# Altium project pay-ssm.PrjPCB (part 2 of 2)

## Sheet MF Thermistors.SchDoc
size A4; DrawnBy: Lorna Lan, Dylan Vogel; DocumentNumber: 17; Revision: v4.1; SheetNumber: 17; SheetTotal: 20
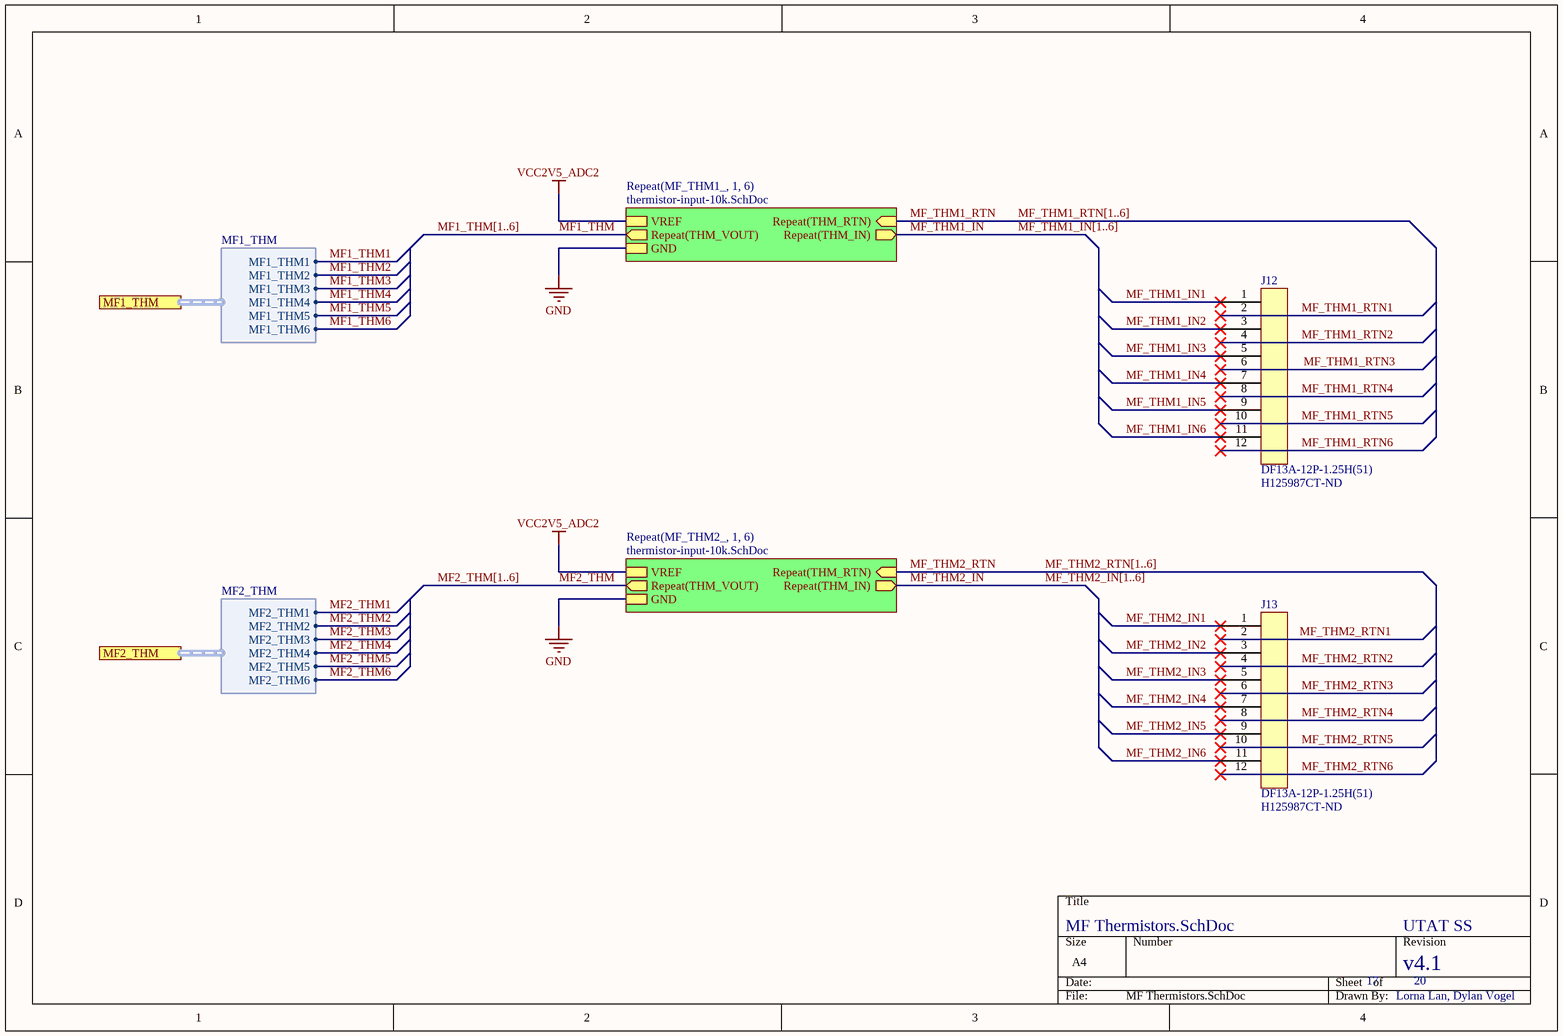
[diagram p8: MF Thermistors.SchDoc]

### Parts
J12  DF13A-12P-1.25H(51)  Supplier Part Number 1: H125987CT-ND  [DF13A-12P-1.25H(51)]
J13  DF13A-12P-1.25H(51)  Supplier Part Number 1: H125987CT-ND  [DF13A-12P-1.25H(51)]

### Sub-sheets
Repeat(MF_THM1_, 1, 6) = thermistor-input-10k.SchDoc (file not in this document): Repeat(THM_IN) (out), Repeat(THM_RTN) (in), Repeat(THM_VOUT) (out), GND, VREF
Repeat(MF_THM2_, 1, 6) = thermistor-input-10k.SchDoc (file not in this document): Repeat(THM_IN) (out), Repeat(THM_RTN) (in), Repeat(THM_VOUT) (out), GND, VREF

### Ports
MF1_THM (harness MF1_THM), MF2_THM (harness MF2_THM)

### Harnesses
MF1_THM: MF1_THM1, MF1_THM2, MF1_THM3, MF1_THM4, MF1_THM5, MF1_THM6
MF2_THM: MF2_THM1, MF2_THM2, MF2_THM3, MF2_THM4, MF2_THM5, MF2_THM6

### Nets
GND: sheet Repeat(MF_THM1_, 1, 6)/GND, sheet Repeat(MF_THM2_, 1, 6)/GND
VCC2V5_ADC2: sheet Repeat(MF_THM1_, 1, 6)/VREF, sheet Repeat(MF_THM2_, 1, 6)/VREF
MF1_THM: sheet Repeat(MF_THM1_, 1, 6)/Repeat(THM_VOUT)
MF1_THM1: port MF1_THM.MF1_THM1
MF1_THM2: port MF1_THM.MF1_THM2
MF1_THM3: port MF1_THM.MF1_THM3
MF1_THM4: port MF1_THM.MF1_THM4
MF1_THM5: port MF1_THM.MF1_THM5
MF1_THM6: port MF1_THM.MF1_THM6
MF2_THM: sheet Repeat(MF_THM2_, 1, 6)/Repeat(THM_VOUT)
MF2_THM1: port MF2_THM.MF2_THM1
MF2_THM2: port MF2_THM.MF2_THM2
MF2_THM3: port MF2_THM.MF2_THM3
MF2_THM4: port MF2_THM.MF2_THM4
MF2_THM5: port MF2_THM.MF2_THM5
MF2_THM6: port MF2_THM.MF2_THM6
MF_THM1_IN: sheet Repeat(MF_THM1_, 1, 6)/Repeat(THM_IN)
MF_THM1_IN1: J12.1
MF_THM1_IN2: J12.3
MF_THM1_IN3: J12.5
MF_THM1_IN4: J12.7
MF_THM1_IN5: J12.9
MF_THM1_IN6: J12.11
MF_THM1_RTN: sheet Repeat(MF_THM1_, 1, 6)/Repeat(THM_RTN)
MF_THM1_RTN1: J12.2
MF_THM1_RTN2: J12.4
MF_THM1_RTN3: J12.6
MF_THM1_RTN4: J12.8
MF_THM1_RTN5: J12.10
MF_THM1_RTN6: J12.12
MF_THM2_IN: sheet Repeat(MF_THM2_, 1, 6)/Repeat(THM_IN)
MF_THM2_IN1: J13.1
MF_THM2_IN2: J13.3
MF_THM2_IN3: J13.5
MF_THM2_IN4: J13.7
MF_THM2_IN5: J13.9
MF_THM2_IN6: J13.11
MF_THM2_RTN: sheet Repeat(MF_THM2_, 1, 6)/Repeat(THM_RTN)
MF_THM2_RTN1: J13.2
MF_THM2_RTN2: J13.4
MF_THM2_RTN3: J13.6
MF_THM2_RTN4: J13.8
MF_THM2_RTN5: J13.10
MF_THM2_RTN6: J13.12

### Buses and harness runs
bus MF1_THM[1..6]
bus MF2_THM[1..6]
bus MF_THM1_IN[1..6]
bus MF_THM1_RTN[1..6]
bus MF_THM2_IN[1..6]
bus MF_THM2_RTN[1..6]

### Library data of the parts
J12 J13 = DF13A-12P-1.25H(51): 12 pos DF13 right angle surface mount connector; Manufacturer: Hirose; Current Rating: 1A; Voltage Rating: 150V; Contact Resistance: 30mR; Number of Positions: 12; Pitch: 1.25mm; Supplier 1: Digi-Key; Manufacturer Part Number: DF13A-12P-1.25H(51); Stock 1: 878; Pricing 1: 1=1.69, 10=1.536, 100=1.3167, 500=1.09726 (USD); Contact Material: Brass,Copper Alloy; Contact Plating: Gold; Housing Color: Beige; Housing Material: Polyamide; Min Operating Temperature: -35°C; Max Operating Temperature: 85°C; Contact Gender: Male; Package Quantity: 1000; Number of Rows: 1; Packaging: Tape and Reel; Max Current Rating: 1A; Termination: Solder; Number of Contacts: 12; Max Voltage Rating (AC): 150V; Orientation: Right Angle; Length: 19.65mm; Depth: 6.5mm; Radiation Hardening: No; Lead Free: Lead Free; ComponentLink1URL: http://www.mouser.com/ds/2/185/DF13_catalog-939190.pdf?src-supplier=Mouser; ComponentLink1Description: http://www.mouser.com/ds/2/185/DF13_catalog-939190.pdf?src-supplier=Mouser; ComponentLink2URL: http://www.hirose.co.jp/cataloge_hp/en_DF13_20130411.pdf?src-supplier=Future+Electronics; ComponentLink2Description: http://www.hirose.co.jp/cataloge_hp/en_DF13_20130411.pdf?src-supplier=Future+Electronics; ComponentLink3URL: https://www.verical.com/server-webapp/html/getDatasheet?partID=429813&src-supplier=Verical; ComponentLink3Description: https://www.verical.com/server-webapp/html/getDatasheet?partID=429813&src-supplier=Verical

## Sheet ADC Breakout.SchDoc
size A4; DrawnBy: Lorna Lan, Dylan Vogel; DocumentNumber: 7; Revision: v4.2; SheetNumber: 7; SheetTotal: 20
Used 2 times, as channels ADC1, ADC2. Parts and nets are listed once, with the designators drawn on the sheet.
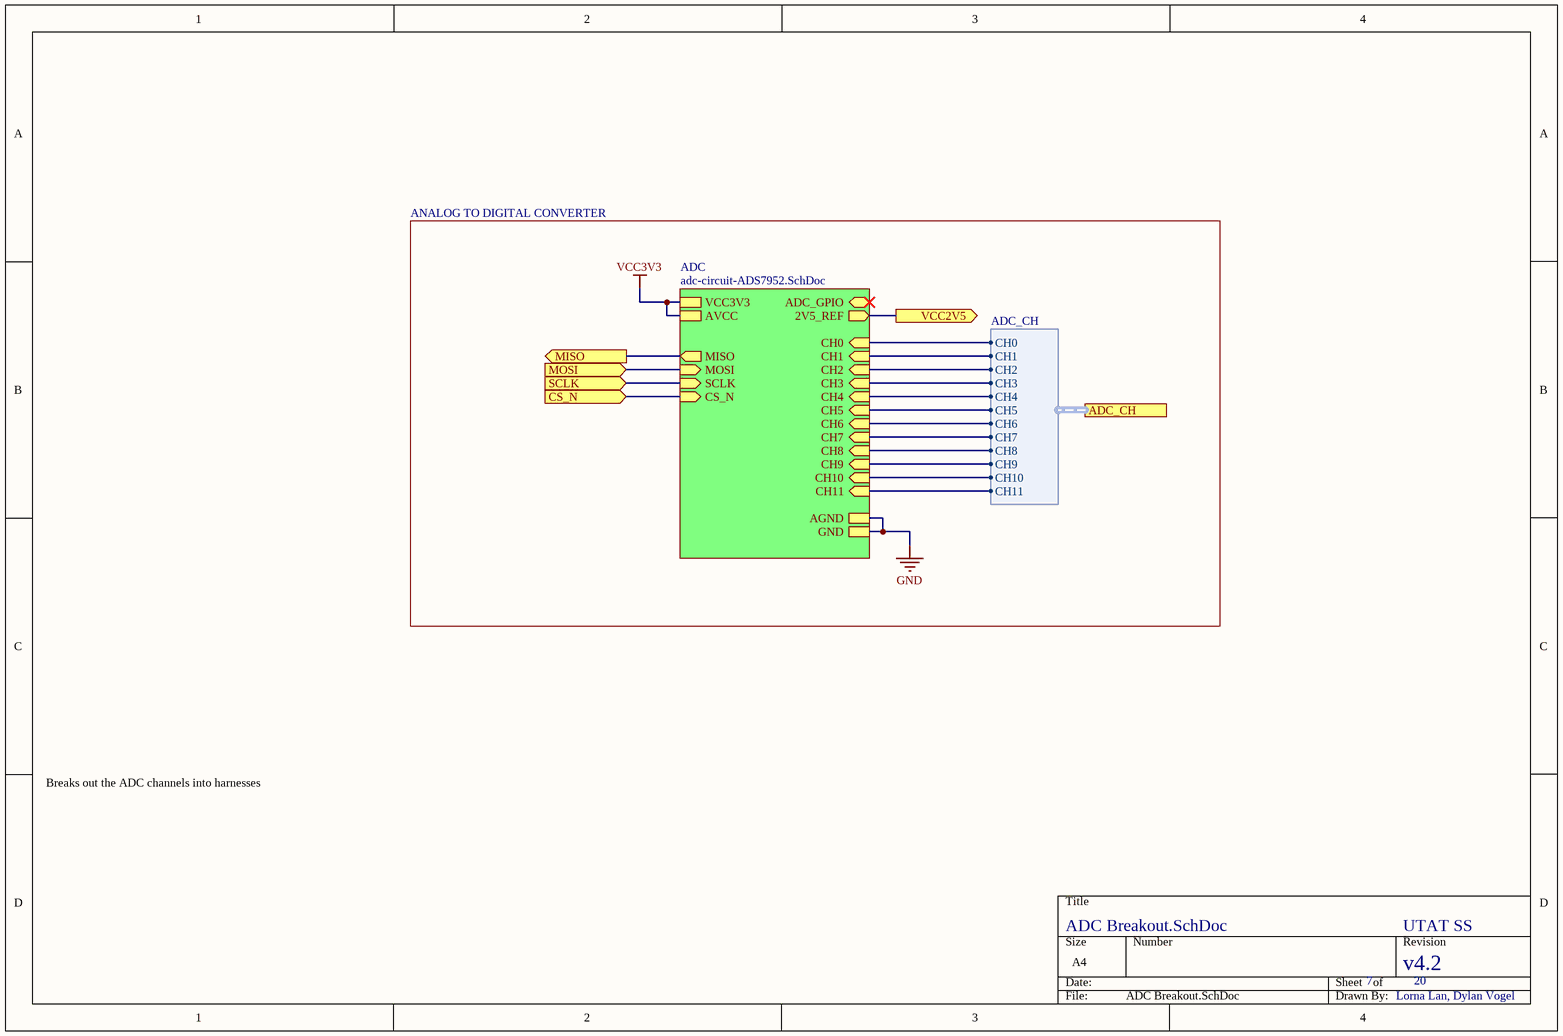
[diagram p9: ADC Breakout.SchDoc]

### Sub-sheets
ADC = adc-circuit-ADS7952.SchDoc (file not in this document): ADC_GPIO (bidir), CS_N (in), SCLK (in), MOSI (in), CH9 (in), CH7 (in), CH8 (in), MISO (out), CH10 (in), CH5 (in), CH1 (in), CH4 (in), CH3 (in), CH11 (in), CH0 (in), VCC3V3, 2V5_REF (out), CH2 (in), AVCC, AGND, CH6 (in), GND

### Ports
ADC_CH (harness ADC_CH), CS_N (in), MISO (out), MOSI (in), SCLK (in), VCC2V5 (out)

### Harnesses
ADC_CH: CH0, CH1, CH2, CH3, CH4, CH5, CH6, CH7, CH8, CH9, CH10, CH11

### Nets
GND: sheet ADC/AGND, sheet ADC/GND
VCC3V3: sheet ADC/VCC3V3, sheet ADC/AVCC
CS_N: port CS_N, sheet ADC/CS_N
MISO: port MISO, sheet ADC/MISO
MOSI: port MOSI, sheet ADC/MOSI
SCLK: port SCLK, sheet ADC/SCLK
VCC2V5: port VCC2V5, sheet ADC/2V5_REF
(unnamed): sheet ADC/CH9, port ADC_CH.CH9
(unnamed): sheet ADC/CH7, port ADC_CH.CH7
(unnamed): sheet ADC/CH8, port ADC_CH.CH8
(unnamed): sheet ADC/CH10, port ADC_CH.CH10
(unnamed): sheet ADC/CH5, port ADC_CH.CH5
(unnamed): sheet ADC/CH1, port ADC_CH.CH1
(unnamed): sheet ADC/CH4, port ADC_CH.CH4
(unnamed): sheet ADC/CH3, port ADC_CH.CH3
(unnamed): sheet ADC/CH11, port ADC_CH.CH11
(unnamed): sheet ADC/CH0, port ADC_CH.CH0
(unnamed): sheet ADC/CH2, port ADC_CH.CH2
(unnamed): sheet ADC/CH6, port ADC_CH.CH6

### Channels
ADC1: ports CS_N=ADC1_CS_N MISO=MISO MOSI=MOSI SCLK=SCK VCC2V5=VCC2V5_ADC1
ADC2: ports CS_N=ADC2_CS_N MISO=MISO MOSI=MOSI SCLK=SCK VCC2V5=VCC2V5_ADC2

### Notes on the sheet
- ANALOG TO DIGITAL CONVERTER
- Breaks out the ADC channels into harnesses

## Sheet Boost Converter 6V.SchDoc
size A4; DrawnBy: Lorna Lan; DocumentNumber: 14; Revision: v4.2; SheetNumber: 14; SheetTotal: 20
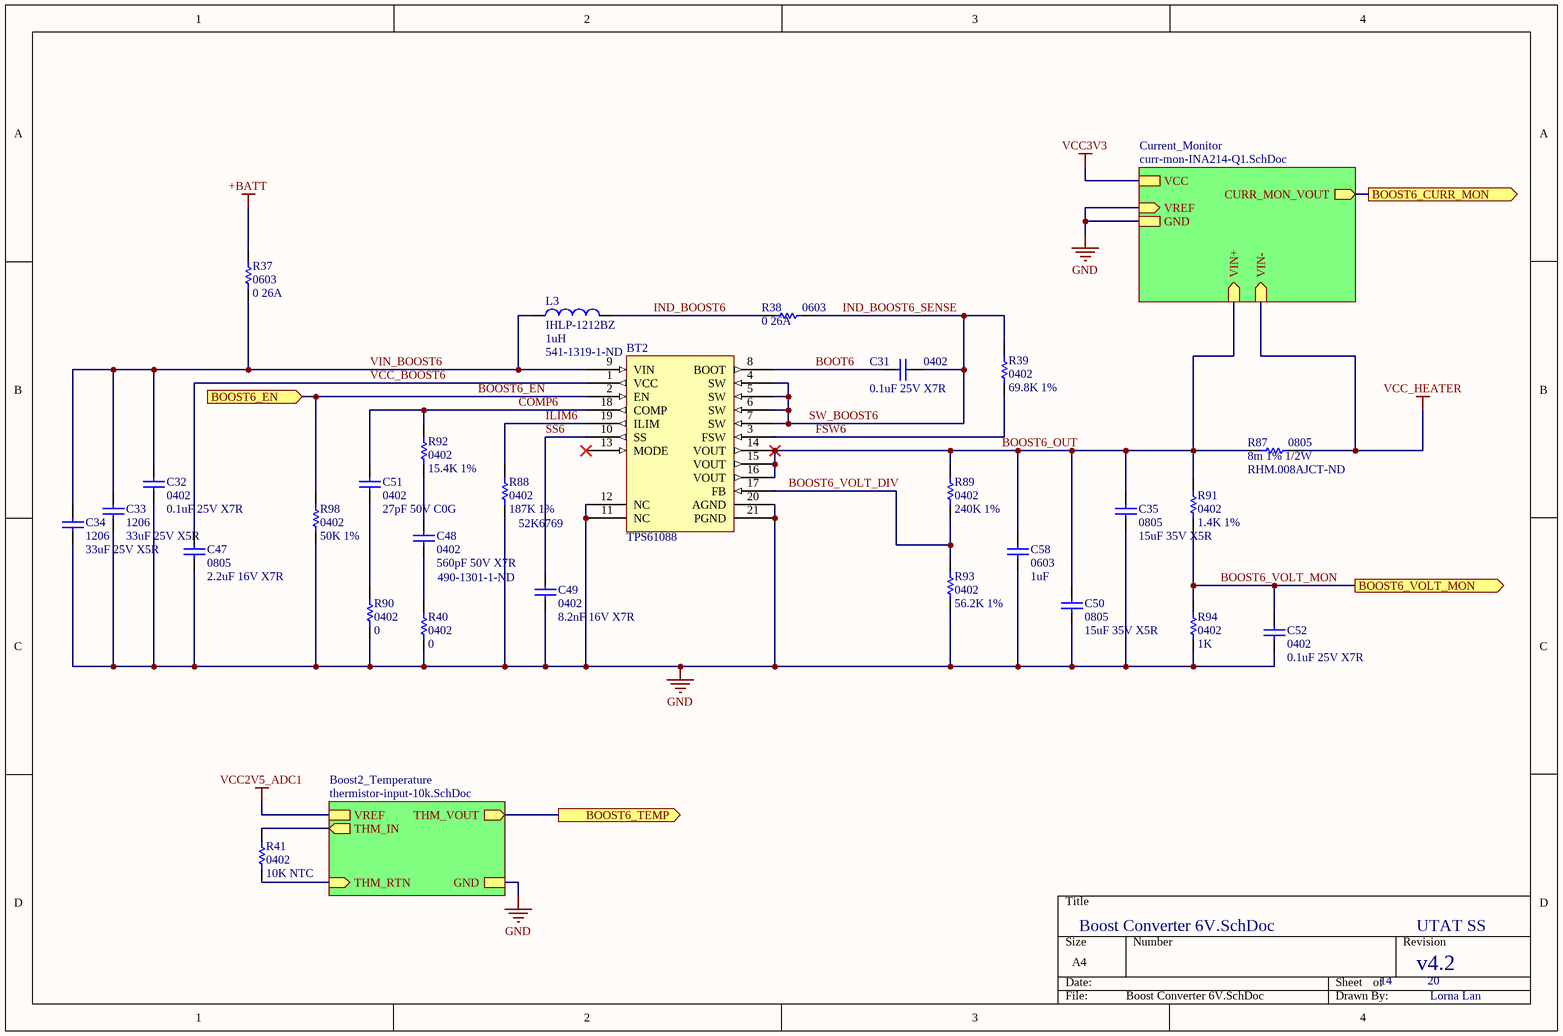
[diagram p10: Boost Converter 6V.SchDoc]

### Parts
BT2  TPS61088  [QFN50P450X350X100-21N]
C31  0402  value 0.1uF 25V X7R  [CAP0402R]
C32  0402  value 0.1uF 25V X7R  [CAP0402R]
C33  1206  value 33uF 25V X5R  [CAP1206R]
C34  1206  value 33uF 25V X5R  [CAP1206R]
C35  0805  value 15uF 35V X5R  [CAP0805R]
C47  0805  value 2.2uF 16V X7R  [CAP0805R]
C48  0402  value 560pF 50V X7R  Supplier Part Number 1: 490-1301-1-ND  [CAP0402R]
C49  0402  value 8.2nF 16V X7R  [CAP0402R]
C50  0805  value 15uF 35V X5R  [CAP0805R]
C51  0402  value 27pF 50V C0G  [CAP0402R]
C52  0402  value 0.1uF 25V X7R  [CAP0402R]
C58  0603  value 1uF  [CAP0603R]
L3  IHLP-1212BZ  Inductance: 1uH  Supplier Part Number 1: 541-1319-1-ND  [IHLP-1212BZ]
R37  0603  value 0 26A  [RES0603R]
R38  0603  value 0 26A  [RES0603R]
R39  0402  value 69.8K 1%  [RES0402R]
R40  0402  value 0  [RES0402R]
R41  0402  value 10K NTC  [RES0402R]
R87  0805  value 8m 1% 1/2W  Supplier Part Number 1: RHM.008AJCT-ND  [RES0805R]
R88  0402  value 187K 1%  Supplier Part Number 1: 52K6769  [RES0402R]
R89  0402  value 240K 1%  [RES0402R]
R90  0402  value 0  [RES0402R]
R91  0402  value 1.4K 1%  [RES0402R]
R92  0402  value 15.4K 1%  [RES0402R]
R93  0402  value 56.2K 1%  [RES0402R]
R94  0402  value 1K  [RES0402R]
R98  0402  value 50K 1%  [RES0402R]

### Sub-sheets
Boost2_Temperature = thermistor-input-10k.SchDoc (file not in this document): GND, VREF, THM_RTN (in), THM_IN (out), THM_VOUT (out)
Current_Monitor = curr-mon-INA214-Q1.SchDoc (file not in this document): VCC, VREF (in), VIN+ (in), GND, VIN- (in), CURR_MON_VOUT (out)

### Ports
BOOST6_CURR_MON (out), BOOST6_EN (in), BOOST6_TEMP (out), BOOST6_VOLT_MON (out)

### Nets
+BATT: R37.2
GND: BT2.11(NC) BT2.12(NC) BT2.20(AGND) BT2.21(PGND) C32.1 C33.1 C34.1 C35.1 C47.1 C49.1 C50.1 C52.1 C58.1 R40.1 R88.1 R90.1 R93.1 R94.1 R98.1 ; sheet Boost2_Temperature/GND, sheet Current_Monitor/VREF, sheet Current_Monitor/GND
VCC2V5_ADC1: sheet Boost2_Temperature/VREF
VCC_HEATER: R87.2 ; sheet Current_Monitor/VIN-
BOOST6_CURR_MON: port BOOST6_CURR_MON, sheet Current_Monitor/CURR_MON_VOUT
BOOST6_EN: BT2.2(EN) R98.2 ; port BOOST6_EN
BOOST6_OUT: BT2.14(VOUT) BT2.15(VOUT) BT2.16(VOUT) C35.2 C50.2 C58.2 R87.1 R89.2 R91.2 ; sheet Current_Monitor/VIN+
BOOST6_TEMP: port BOOST6_TEMP, sheet Boost2_Temperature/THM_VOUT
BOOST6_VOLT_DIV: BT2.17(FB) R89.1 R93.2
BOOST6_VOLT_MON: C52.2 R91.1 R94.2 ; port BOOST6_VOLT_MON
BOOT6: BT2.8(BOOT) C31.1
COMP6: BT2.18(COMP) C51.2 R92.2
FSW6: BT2.3(FSW) R39.1
ILIM6: BT2.19(ILIM) R88.2
IND_BOOST6: L3.2 R38.1
IND_BOOST6_SENSE: BT2.4(SW) BT2.5(SW) BT2.6(SW) BT2.7(SW) C31.2 R38.2 R39.2  [also labelled SW_BOOST6]
SS6: BT2.10(SS) C49.2
VCC_BOOST6: BT2.1(VCC) C47.2
VIN_BOOST6: BT2.9(VIN) C32.2 C33.2 C34.2 L3.1 R37.1
NetC48_1: C48.1 R40.2
NetC48_2: C48.2 R92.1
NetC51_1: C51.1 R90.2
NetR41_1: R41.1 ; sheet Boost2_Temperature/THM_RTN
NetR41_2: R41.2 ; sheet Boost2_Temperature/THM_IN

Not connected (* = marked no-connect by the designer): BT2 13(MODE)*

### Library data of the parts
BT2 = TPS61088: Boost converter; Supplier 1: Digi-Key; Supplier Part Number 1: 296-42129-1-ND
C31 C32 C48 C49 C51 C52 = CAP0402: 0402 capacitor
  C48: Supplier 1: Digi-Key
  C49: Supplier 1: Digi-Key; Supplier Part Number 1: 490-6338-1-ND
  C51: Supplier 1: Digi-Key; Supplier Part Number 1: 490-5869-1-ND
C33 C34 = CAP1206: 1206 capacitor; Supplier 1: Digi-Key; Supplier Part Number 1: 445-8046-1-ND
C35 C47 C50 = CAP0805: 0805 capacitor
  C35 C50: Supplier 1: Mouser; Supplier Part Number 1: 810-C2012X5R1V156M1C
  C47: Supplier 1: Digi-Key; Supplier Part Number 1: 490-3906-1-ND
C58 = CAP0603: 0603 capacitor; Manufacturer: KEMET; Manufacturer Part Number: C0603C105K4RACAUTO; Tolerance: 10%; Voltage Rating: 16V; Supplier 1: Digi-Key; Supplier Part Number 1: 399-17704-1-ND; Stock 1: 376276; Pricing 1: 1=0.17, 10=0.12, 100=0.0564, 500=0.03952, 1000=0.03273 (USD); Mount: Surface Mount; Case/Package: 0603; Case Code (Imperial): 0603; Case Code (Metric): 1608; Min Operating Temperature: -55°C; Max Operating Temperature: 125°C; Packaging: Cut Tape; Capacitance: 1uF; Ratings: AEC-Q200; Supplier 2: Digi-Key; Supplier Part Number 2: 587-3467-1-ND
L3 = IND_IHLP-1212BZ: 1µH Shielded Molded Inductor 5A 24mOhm Max Nonstandard; Manufacturer: Vishay Dale; Manufacturer Part Number: IHLP1212BZER1R0M11; Core Material: Metal,Composite; Self Resonant Frequency: 75MHz; Saturation Current: 4.5A; Tolerance: 20%; DC Resistance (DCR): 24mR; Test Frequency: 100kHz; Supplier 1: Digi-Key; Stock 1: 196362; Pricing 1: 1=1.45, 10=1.346, 100=0.9729, 500=0.7452, 1000=0.6624 (USD); Mount: Surface Mount; Case/Package: 1212; Number of Pins: 2; Case Code (Metric): 3630; Case Code (Imperial): 1212; Contact Plating: Tin; Min Operating Temperature: -55°C; Max Operating Temperature: 125°C; Shielding: Shielded; Packaging: Tape and Reel; Package Quantity: 3000; Current Rating: 5A; Inductance Tolerance: 20%; Max DC Current: 5A; Termination: SMD/SMT; RMS Current (Irms): 5A; Military Standard: Not; Length: 3.6mm; Height: 2mm; Width: 0.118inch; Height - Seated (Max): 0.079inch; Depth: 3.2mm; Radiation Hardening: No; REACH SVHC: Unknown; Lead Free: Lead Free; ComponentLink1URL: http://www.mouser.com/ds/2/427/lp12bz11-244380.pdf?src-supplier=Mouser; ComponentLink1Description: http://www.mouser.com/ds/2/427/lp12bz11-244380.pdf?src-supplier=Mouser; ComponentLink2URL: http://www.vishay.com/docs/34289/lp12bz11.pdf?src-supplier=Digi-Key; ComponentLink2Description: http://www.vishay.com/docs/34289/lp12bz11.pdf?src-supplier=Digi-Key; ComponentLink3URL: http://www.vishay.com/docs/34289/lp12bz11.pdf?src-supplier=Avnet; ComponentLink3Description: http://www.vishay.com/docs/34289/lp12bz11.pdf?src-supplier=Avnet; ComponentLink4URL: http://www.farnell.com/datasheets/652599.pdf?src-supplier=Element14; ComponentLink4Description: http://www.farnell.com/datasheets/652599.pdf?src-supplier=Element14; ComponentLink5URL: http://www.vishay.com/docs/34289/lp12bz11.pdf?src-supplier=Avnet+Europe; ComponentLink5Description: http://www.vishay.com/docs/34289/lp12bz11.pdf?src-supplier=Avnet+Europe; ComponentLink6URL: https://www.verical.com/server-webapp/html/getDatasheet?partID=180380&src-supplier=Verical; ComponentLink6Description: https://www.verical.com/server-webapp/html/getDatasheet?partID=180380&src-supplier=Verical
R37 R38 = RES0603: 0603 resistor; Supplier 1: Digi-Key; Supplier Part Number 1: 2019-TLRZ1JTTDCT-ND
R39 R41 R88 R89 R91-R94 R98 = RES0402: 0402 resistor
  R39: Supplier 1: Digi-Key; Supplier Part Number 1: 541-69.8KLCT-ND
  R88: Supplier 1: Newark
  R89 R93: Supplier 1: Digi-Key; Supplier Part Number 1: 541-118KLCT-ND
  R94: Supplier 1: Digi-Key; Supplier Part Number 1: YAG1234CT-ND
R40 R90 = RES0402: 0402 resistor; Manufacturer: Panasonic; Manufacturer Part Number: ERJ-2GE0R00X; Resistance: 0mR; Power Rating: 100mW; Voltage Rating: 50V; Tolerance: 5%; Temperature Coefficient: 600ppm/°C; Supplier 1: Digi-Key; Supplier Part Number 1: P0.0JCT-ND; Stock 1: 47740000; Pricing 1: 1=0.1, 10=0.03, 25=0.0216, 50=0.0164, 100=0.0121, 250=0.00924, 500=0.0074, 1000=0.00545, 5000=0.00391 (USD); Mount: Surface Mount; Case/Package: 0402; Case Code (Metric): 1005; Case Code (Imperial): 0402; Contact Plating: Tin; Min Operating Temperature: -55°C; Max Operating Temperature: 155°C; Packaging: Tape and Reel; Package Quantity: 1; Composition: Thick Film; Number of Terminations: 2; Termination: SMD/SMT; Military Standard: Not; Max Power Dissipation: 100mW; Voltage Rating (DC): 50V; Features: Automotive AEC-Q200; Length: 1mm; Height: 0.35mm; Width: 0.02inch; Depth: 0.5mm; Radiation Hardening: No; REACH SVHC: No SVHC; Lead Free: Lead Free; ComponentLink1URL: http://industrial.panasonic.com/www-data/pdf/AOA0000/AOA0000CE1.pdf?src-supplier=Avnet; ComponentLink1Description: http://industrial.panasonic.com/www-data/pdf/AOA0000/AOA0000CE1.pdf?src-supplier=Avnet; ComponentLink2URL: http://www.alliedelec.com/m/d/51cd0790071e1666bdb9d00c57fcf960.pdf?src-supplier=Allied+Electronics; ComponentLink2Description: http://www.alliedelec.com/m/d/51cd0790071e1666bdb9d00c57fcf960.pdf?src-supplier=Allied+Electronics; ComponentLink3URL: http://industrial.panasonic.com/www-data/pdf/AOA0000/AOA0000CE1.pdf?src-supplier=Avnet+Europe; ComponentLink3Description: http://industrial.panasonic.com/www-data/pdf/AOA0000/AOA0000CE1.pdf?src-supplier=Avnet+Europe; ComponentLink4URL: http://www.farnell.com/datasheets/2059623.pdf?src-supplier=Farnell; ComponentLink4Description: http://www.farnell.com/datasheets/2059623.pdf?src-supplier=Farnell; ComponentLink5URL: http://www.farnell.com/datasheets/2059623.pdf?src-supplier=Element14; ComponentLink5Description: http://www.farnell.com/datasheets/2059623.pdf?src-supplier=Element14; ComponentLink6URL: http://www.farnell.com/datasheets/1678796.pdf?src-supplier=Element14; ComponentLink6Description: http://www.farnell.com/datasheets/1678796.pdf?src-supplier=Element14
R87 = RES0805: 0805 resistor; Supplier 1: Digi-Key

## Nets that join several sheets
+BATT: TOP (9 pins), Boost Converter 10V (R86.2), Boost Converter 6V (R37.2)
GND: TOP (22 pins), Environmental Sensors (6 pins), Boost Converter 10V (20 pins), Motors State Monitor (R46.1 R47.1), MOTORS/MOTOR_DRV1 (21 pins), MOTORS/MOTOR_DRV2 (21 pins), HEATER1 (Q1_HEATER1.4 Q2_HEATER1.4 R44_HEATER1.1), HEATER2 (Q1_HEATER2.4 Q2_HEATER2.4 R44_HEATER2.1), HEATER3 (Q1_HEATER3.4 Q2_HEATER3.4 R44_HEATER3.1), HEATER4 (Q1_HEATER4.4 Q2_HEATER4.4 R44_HEATER4.1), HEATER5 (Q1_HEATER5.4 Q2_HEATER5.4 R44_HEATER5.1), Boost Converter 6V (19 pins)
VCC3V3: TOP (6 pins), Environmental Sensors (6 pins), Motors State Monitor (J9.1 J10.1), MOTORS/MOTOR_DRV1 (R48_MOTOR_DRV1.2 R49_MOTOR_DRV1.2), MOTORS/MOTOR_DRV2 (R48_MOTOR_DRV2.2 R49_MOTOR_DRV2.2), HEATER1 (R66_HEATER1.2), HEATER2 (R66_HEATER2.2), HEATER3 (R66_HEATER3.2), HEATER4 (R66_HEATER4.2), HEATER5 (R66_HEATER5.2)
VCC_HEATER: TOP (R7.2), HEATER1 (J11_HEATER1.1 R65_HEATER1.2 R96_HEATER1.2), HEATER2 (J11_HEATER2.1 R65_HEATER2.2 R96_HEATER2.2), HEATER3 (J11_HEATER3.1 R65_HEATER3.2 R96_HEATER3.2), HEATER4 (J11_HEATER4.1 R65_HEATER4.2 R96_HEATER4.2), HEATER5 (J11_HEATER5.1 R65_HEATER5.2 R96_HEATER5.2), Boost Converter 6V (R87.2)
VCC_MOTOR: TOP (R3.2), Boost Converter 10V (R28.2), MOTORS/MOTOR_DRV1 (6 pins), MOTORS/MOTOR_DRV2 (6 pins)
A_PHASE_MOT2: TOP (J14.12), MOTORS/MOTOR_DRV2 (R60_MOTOR_DRV2.2 U7_MOTOR_DRV2.13)
AOUT1: Motors (J6.4), MOTORS/MOTOR_DRV2 (U7_MOTOR_DRV2.4)
AOUT1: Motors (J5.3), MOTORS/MOTOR_DRV1 (U7_MOTOR_DRV1.4)
AOUT2: Motors (J6.3), MOTORS/MOTOR_DRV2 (U7_MOTOR_DRV2.6)
AOUT2: Motors (J5.4), MOTORS/MOTOR_DRV1 (U7_MOTOR_DRV1.6)
B_PHASE_MOT2: TOP (J14.10), MOTORS/MOTOR_DRV2 (R61_MOTOR_DRV2.2 U7_MOTOR_DRV2.12)
BOUT1: Motors (J6.2), MOTORS/MOTOR_DRV2 (U7_MOTOR_DRV2.9)
BOUT1: Motors (J5.1), MOTORS/MOTOR_DRV1 (U7_MOTOR_DRV1.9)
BOUT2: Motors (J6.1), MOTORS/MOTOR_DRV2 (U7_MOTOR_DRV2.7)
BOUT2: Motors (J5.2), MOTORS/MOTOR_DRV1 (U7_MOTOR_DRV1.7)
MISO: TOP (J2.12 J14.11), Environmental Sensors (U9.8 U10.5)
MOSI: TOP (J2.8 J14.13), Environmental Sensors (U9.7)
SCK: TOP (J2.16 J14.14), Environmental Sensors (U9.1 U10.4)

## Assembly variants
Default Population: not fitted D7 R3 R7 R69_Port_Expander1 R69_Port_Expander2 R70_Port_Expander1 R71_Port_Expander2 R73_Port_Expander2 R74_Port_Expander1 R85